# EAGLE design motor-shield02 (EAGLE 7.5.0)
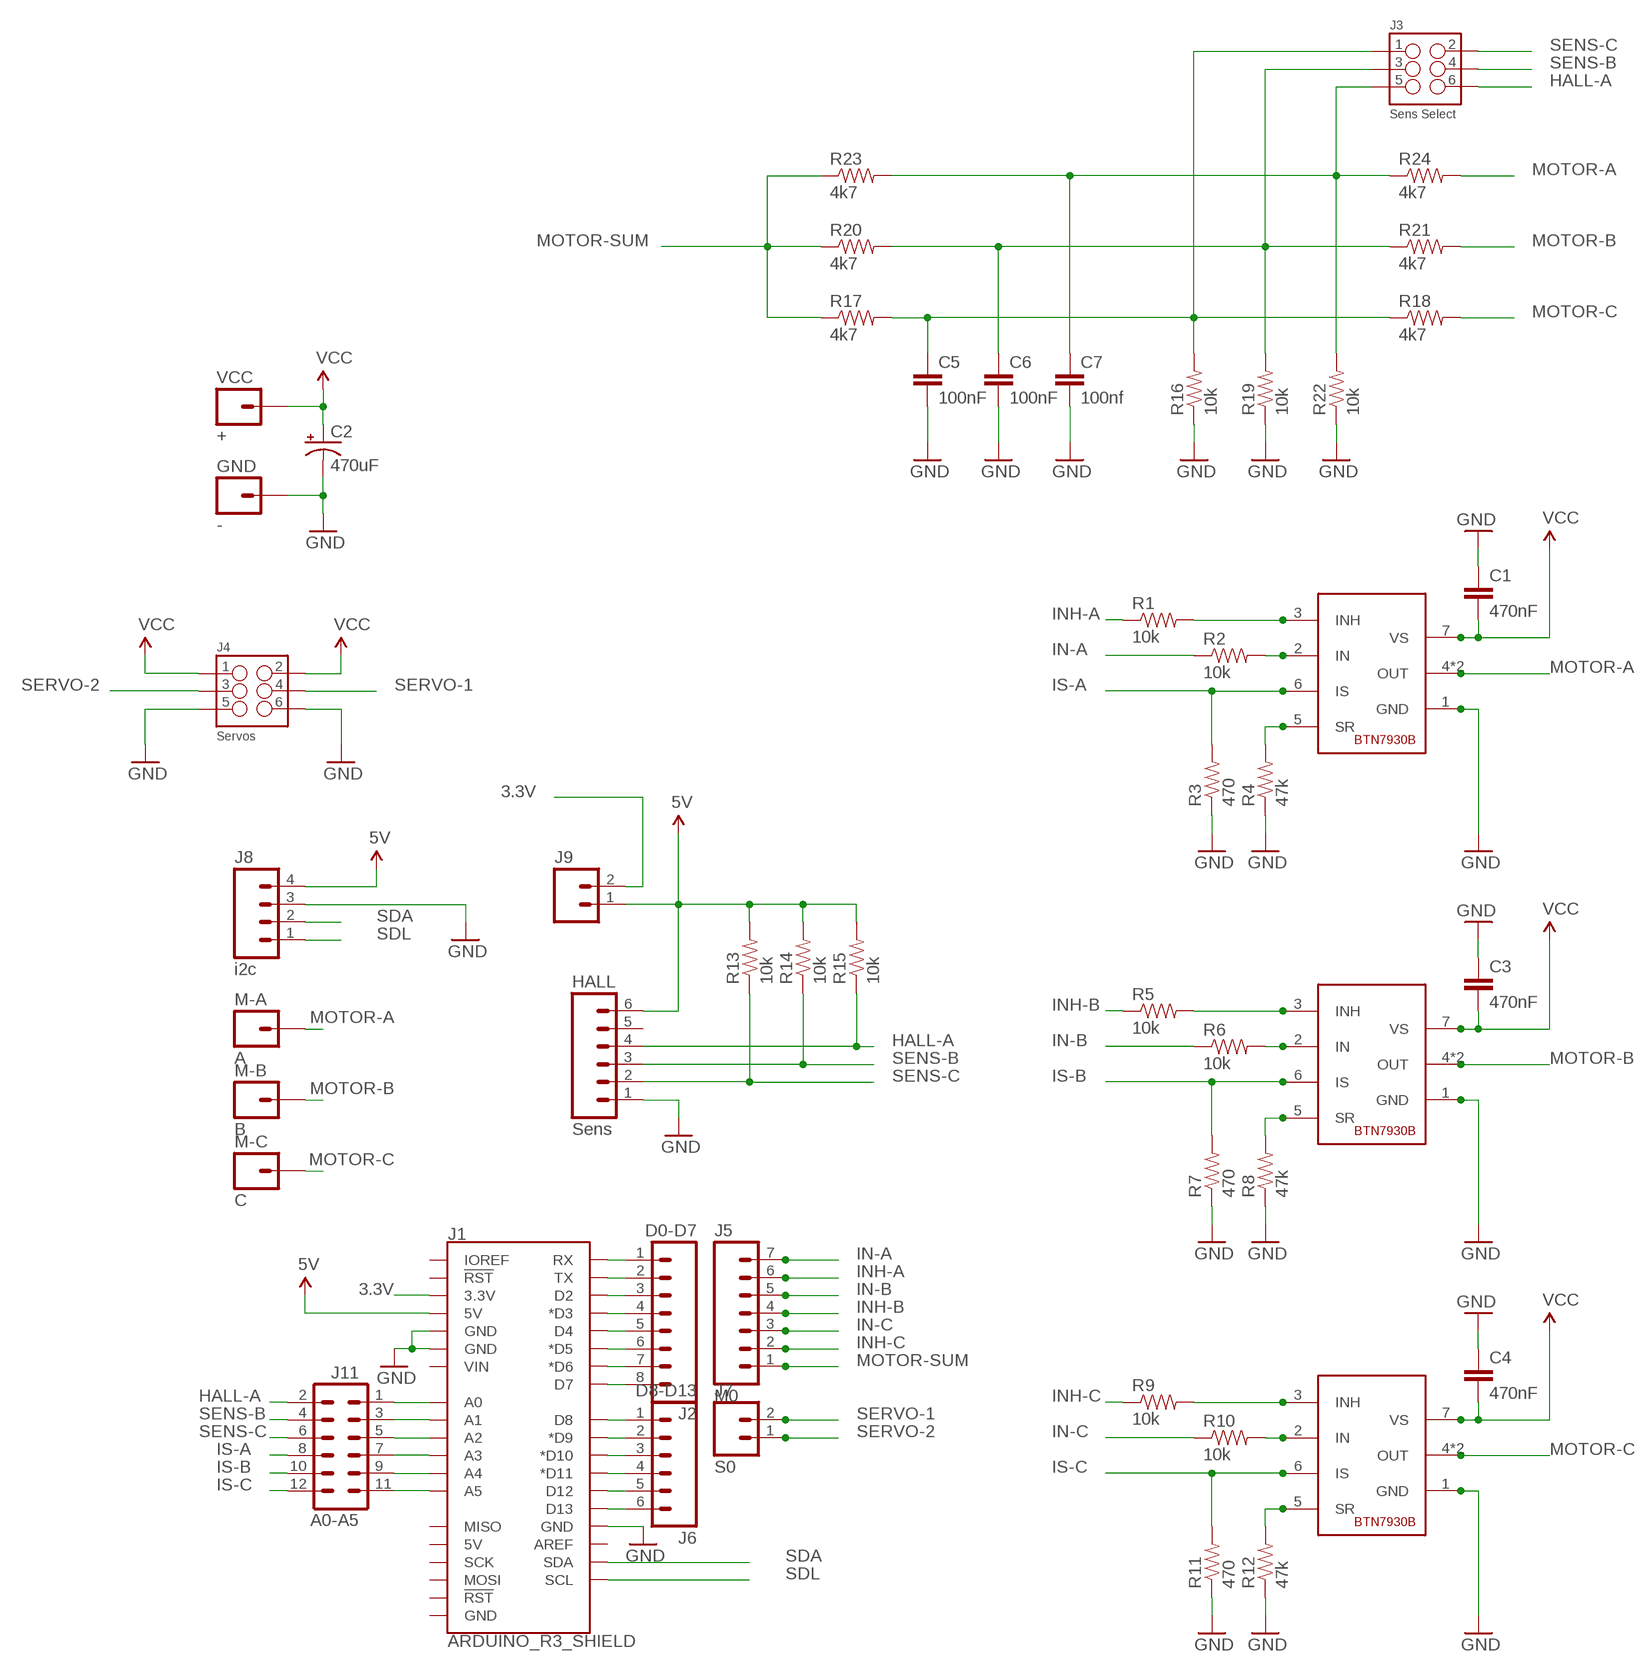
[diagram p0: schematic, sheet 1]

## Parts
C1  470nF  CAPEZ  [CAP-PTH-SMALLEZ]
C2  470uF  CAP_POLPTH1  [CPOL-RADIAL-100UF-25V]
C3  470nF  CAPEZ  [CAP-PTH-SMALLEZ]
C4  470nF  CAPEZ  [CAP-PTH-SMALLEZ]
C5  100nF  CAPEZ  [CAP-PTH-SMALLEZ]
C6  100nF  CAPEZ  [CAP-PTH-SMALLEZ]
C7  100nf  CAPEZ  [CAP-PTH-SMALLEZ]
DA  H-Bridge  INF-PG-TO263-7-1_L_1  [INF-PG-TO263-7-1_L_1PRIMARY]
DB  H-Bridge  INF-PG-TO263-7-1_L_1  [INF-PG-TO263-7-1_L_1PRIMARY]
DC  H-Bridge  INF-PG-TO263-7-1_L_1  [INF-PG-TO263-7-1_L_1PRIMARY]
GND  -  M01SMTRA-256-8-6  [SMTRA-256-8-6]
HALL  Sens  M06SMD-1MM  [1X06-1MM]
J1  ARDUINO_R3_SHIELD  ARDUINO_R3_SHIELD_ICSP  [UNO_R3_SHIELD_ICSP]
J2  D0-D7  M08NO_SILK_FEMALE_PTH  [1X08_NO_SILK]
J3  Sens Select  M03X2FEMALE  [2X3]
J4  Servos  M03X2FEMALE  [2X3]
J5  M0  M07NO_SILK  [1X07_NO_SILK]
J6  D8-D13  M06NO_SILK_YES_STOP  [1X06_NO_SILK_YES_STOP]
J7  S0  M021X02_NO_SILK  [1X02_NO_SILK]
J8  i2c  M04NO_SILK_ALL_ROUND  [1X04_NO_SILK_ALL_ROUND]
J9  M021X02_NO_SILK  [1X02_NO_SILK]
J11  A0-A5  M06X2PTH_FEMALE  [2X6]
M-A  A  M01SMTRA-256-8-6  [SMTRA-256-8-6]
M-B  B  M01SMTRA-256-8-6  [SMTRA-256-8-6]
M-C  C  M01SMTRA-256-8-6  [SMTRA-256-8-6]
R1  10k  10KOHM-1/4W-1%(PTH)HORIZ  [AXIAL-0.3]
R2  10k  10KOHM-1/4W-1%(PTH)HORIZ  [AXIAL-0.3]
R3  470  10KOHM-1/4W-1%(PTH)HORIZ  [AXIAL-0.3]
R4  47k  10KOHM-1/4W-1%(PTH)HORIZ  [AXIAL-0.3]
R5  10k  10KOHM-1/4W-1%(PTH)HORIZ  [AXIAL-0.3]
R6  10k  10KOHM-1/4W-1%(PTH)HORIZ  [AXIAL-0.3]
R7  470  10KOHM-1/4W-1%(PTH)HORIZ  [AXIAL-0.3]
R8  47k  10KOHM-1/4W-1%(PTH)HORIZ  [AXIAL-0.3]
R9  10k  10KOHM-1/4W-1%(PTH)HORIZ  [AXIAL-0.3]
R10  10k  10KOHM-1/4W-1%(PTH)HORIZ  [AXIAL-0.3]
R11  470  10KOHM-1/4W-1%(PTH)HORIZ  [AXIAL-0.3]
R12  47k  10KOHM-1/4W-1%(PTH)HORIZ  [AXIAL-0.3]
R13  10k  10KOHM-1/4W-1%(PTH)HORIZ  [AXIAL-0.3]
R14  10k  10KOHM-1/4W-1%(PTH)HORIZ  [AXIAL-0.3]
R15  10k  10KOHM-1/4W-1%(PTH)HORIZ  [AXIAL-0.3]
R16  10k  10KOHM-1/4W-1%(PTH)HORIZ  [AXIAL-0.3]
R17  4k7  10KOHM-1/4W-1%(PTH)HORIZ  [AXIAL-0.3]
R18  4k7  10KOHM-1/4W-1%(PTH)HORIZ  [AXIAL-0.3]
R19  10k  10KOHM-1/4W-1%(PTH)HORIZ  [AXIAL-0.3]
R20  4k7  10KOHM-1/4W-1%(PTH)HORIZ  [AXIAL-0.3]
R21  4k7  10KOHM-1/4W-1%(PTH)HORIZ  [AXIAL-0.3]
R22  10k  10KOHM-1/4W-1%(PTH)HORIZ  [AXIAL-0.3]
R23  4k7  10KOHM-1/4W-1%(PTH)HORIZ  [AXIAL-0.3]
R24  4k7  10KOHM-1/4W-1%(PTH)HORIZ  [AXIAL-0.3]
VCC  +  M01SMTRA-256-8-6  [SMTRA-256-8-6]

## Nets
3.3V: J1.3.3V J9.2
5V: HALL.6 J1.5V J8.4 J9.1 R13.P$2 R14.P$2 R15.P$2
GND: C1.1 C2.2(-) C3.1 C4.1 C5.2 C6.2 C7.2 DA.1(GND) DB.1(GND) DC.1(GND) GND.P$1 HALL.1 J1.GND@0(GND) J1.GND@1(GND) J1.GND@2(GND) J4.5 J4.6 J8.3 R3.P$1 R4.P$1 R7.P$1 R8.P$1 R11.P$1 R12.P$1 R16.P$1 R19.P$1 R22.P$1
HALL-A: HALL.4 J3.6 J11.2 R15.P$1
IN-A: J5.7 R2.P$1
IN-B: J5.5 R6.P$1
IN-C: J5.3 R10.P$1
INH-A: J5.6 R1.P$1
INH-B: J5.4 R5.P$1
INH-C: J5.2 R9.P$1
IS-A: DA.6(IS) J11.8 R3.P$2
IS-B: DB.6(IS) J11.10 R7.P$2
IS-C: DC.6(IS) J11.12 R11.P$2
MOTOR-A: DA.4(OUT) DA.8(OUT) M-A.P$1 R24.P$2
MOTOR-B: DB.4(OUT) DB.8(OUT) M-B.P$1 R21.P$2
MOTOR-C: DC.4(OUT) DC.8(OUT) M-C.P$1 R18.P$2
MOTOR-SUM: J5.1 R17.P$1 R20.P$1 R23.P$1
N$1: DA.3(INH) R1.P$2
N$2: DA.2(IN) R2.P$2
N$3: DB.3(INH) R5.P$2
N$4: DA.5(SR) R4.P$2
N$5: DB.2(IN) R6.P$2
N$6: DB.5(SR) R8.P$2
N$7: DC.3(INH) R9.P$2
N$8: DC.2(IN) R10.P$2
N$9: DC.5(SR) R12.P$2
N$10: J1.A0 J11.1
N$11: J1.A1 J11.3
N$12: J1.A2 J11.5
N$13: J1.RX J2.1
N$14: J1.TX J2.2
N$15: J1.D2 J2.3
N$16: J1.D3(*D3) J2.4
N$17: J1.D4 J2.5
N$18: J1.D5(*D5) J2.6
N$19: J1.D6(*D6) J2.7
N$20: J1.D7 J2.8
N$21: J1.D8 J6.1
N$22: J1.D9(*D9) J6.2
N$23: J1.D10(*D10) J6.3
N$24: J1.D11(*D11) J6.4
N$25: J1.D12 J6.5
N$26: J1.D13 J6.6
N$31: J1.A3 J11.7
N$32: J1.A4 J11.9
N$33: J1.A5 J11.11
N$42: C5.1 J3.1 R16.P$2 R17.P$2 R18.P$1
N$43: C6.1 J3.3 R19.P$2 R20.P$2 R21.P$1
N$45: C7.1 J3.5 R22.P$2 R23.P$2 R24.P$1
SDA: J1.SDA J8.2
SDL: J1.SCL J8.1
SENS-B: HALL.3 J3.4 J11.4 R14.P$1
SENS-C: HALL.2 J3.2 J11.6 R13.P$1
SERVO-1: J4.4 J7.2
SERVO-2: J4.3 J7.1
VCC: C1.2 C2.1(+) C3.2 C4.2 DA.7(VS) DB.7(VS) DC.7(VS) J4.1 J4.2 VCC.P$1
Unconnected: HALL.5 J1.5V_ICSP(5V) J1.AREF J1.GND_ICSP(GND) J1.IOREF J1.MISO J1.MOSI J1.RES(!RST!) J1.RST_ICSP(!RST!) J1.SCK J1.VIN

## Library data of the parts
C1 C3-C7 = SparkFun-Capacitors:CAP: Capacitor Standard 0603 ceramic capacitor, and 0.1" leaded capacitor.
C2 = SparkFun-Capacitors:CAP_POL: Capacitor Polarized These are standard SMD and PTH capacitors. Normally 10uF, 47uF, and 100uF in electrolytic and tantalum varieties. Always verify the external diameter of the through hole cap, it varies with capacity, voltage, and manufacturer. The EIA devices should be standard.
DA DB DC = BTN7930B-High Current PN Half Bridge:INF-PG-TO263-7-1_L_1
GND M-A M-B M-C VCC = SparkFun-Connectors:M01: Header 1 Standard 1-pin 0.1" header. Use with straight break away headers (SKU : PRT-00116), right angle break away headers (PRT-00553), swiss pins (PRT-00743), machine pins (PRT-00117), and female headers (PRT-00115). SMTSO-256-ET is a "flush mount" nut for a 4-40 screw. The older package used to be too tight, and did not allow it to sit properly thru the drill hit. The latest (0.165DIA) fits nice and snug.
HALL J6 = SparkFun-Connectors:M06: Header 6 Standard 6-pin 0.1" header. Use with straight break away headers (SKU : PRT-00116), right angle break away headers (PRT-00553), swiss pins (PRT-00743), machine pins (PRT-00117), and female headers (PRT-00115). Molex polarized connector foot print use with SKU : PRT-08094 with associated crimp pins and housings. NOTES ON THE VARIANTS LOCK and LOCK_LONGPADS... This footprint was designed to help hold the alignment of a through-hole component (i.e. 6-pin header) while soldering it into place. You may notice that each hole has been shifted either up or down by 0.005 of an inch from it's more standard position (which is a perfectly straight line). This slight alteration caused the pins (the squares in the middle) to touch the edges of the holes. Because they are alternating, it causes a "brace" to hold the component in place. 0.005 has proven to be the perfect amount of "off-center" position when using our standard breakaway headers. Although looks a little odd when you look at the bare footprint, once you have a header in there, the alteration is very hard to notice. Also,if you push a header all the way into place, it is covered up entirely on the bottom side. This idea of altering the position of holes to aid alignment will be further integrated into the Sparkfun Library for other footprints. It can help hold any component with 3 or more connection pins.
J1 = SparkFun-Boards:ARDUINO_R3_SHIELD_ICSP: Arduino R3 Shield Footprint w/ 6-pin (2x3) ICSP Header
J2 = SparkFun-Connectors:M08: Header 8 Standard 8-pin 0.1" header. Use with straight break away headers (SKU : PRT-00116), right angle break away headers (PRT-00553), swiss pins (PRT-00743), machine pins (PRT-00117), and female headers (PRT-00115).; PROD_ID: CONN-08438
J3 J4 = SparkFun-Connectors:M03X2: 2x3 .1" header. Shrouded, with keying- CONN-10681 SMT- CONN-11415 Pogo pins- HW-11044; PROD_ID: CONN-11566; VALUE: FEMALE 2x3
J5 = SparkFun-Connectors:M07: Header 7 Standard 7-pin 0.1" header. Use with straight break away headers (SKU : PRT-00116), right angle break away headers (PRT-00553), swiss pins (PRT-00743), machine pins (PRT-00117), and female headers (PRT-00115). NOTES ON THE VARIANTS LOCK and LOCK_LONGPADS... This footprint was designed to help hold the alignment of a through-hole component (i.e. 7-pin header) while soldering it into place. You may notice that each hole has been shifted either up or down by 0.005 of an inch from it's more standard position (which is usually a perfectly straight line). This slight alteration caused the pins (the squares in the middle) to touch the edges of the holes. Because they are alternating, it causes a "brace" to hold the header in place. 0.005 has proven to be the perfect amount of "off-center" position when using our standard breakaway headers. Although looks a little odd when you look at the bare footprint, once you have a header in there, the alteration is very hard to notice. Also, if you push a header all the way into place, it is covered up entirely on the bottom side. This idea of altering the position of holes to aid alignment will be further integrated into the Sparkfun Library for other footprints. It can help hold any component with 3 or more connection pins.
J7 J9 = SparkFun-Connectors:M02: Standard 2-pin 0.1" header. Use with - straight break away headers ( PRT-00116) - right angle break away headers (PRT-00553) - swiss pins (PRT-00743) - machine pins (PRT-00117) - female headers (PRT-00115) Molex polarized connector foot print use with: PRT-08233 with associated crimp pins and housings. 2.54_SCREWTERM for use with PRT-10571. 3.5mm Screw Terminal footprints for PRT-08084 5mm Screw Terminal footprints for use with PRT-08432
J8 = SparkFun-Connectors:M04: Header 4 Standard 4-pin 0.1" header. Use with straight break away headers (SKU : PRT-00116), right angle break away headers (PRT-00553), swiss pins (PRT-00743), machine pins (PRT-00117), and female headers (PRT-00115). Molex polarized connector foot print use with SKU : PRT-08231 with associated crimp pins and housings. 1MM SMD Version SKU: PRT-10208; PROD_ID: CONN-09696
J11 = SparkFun-Connectors:M06X2; PROD_ID: CONN-12423; VALUE: 2X6 FEMALE
R1 R2 R5 R6 R9 R10 R13-R16 R19 R22 = SparkFun-Resistors:10KOHM-1/4W-1%(PTH): RES-12183; PROD_ID: RES-12183
R3 R4 R7 R8 R11 R12 R17 R18 R20 R21 R23 R24 = SparkFun-Resistors:10KOHM-1/4W-1%(PTH): RES-12183; PROD_ID: RES-12183; VALUE: 10k

## Board
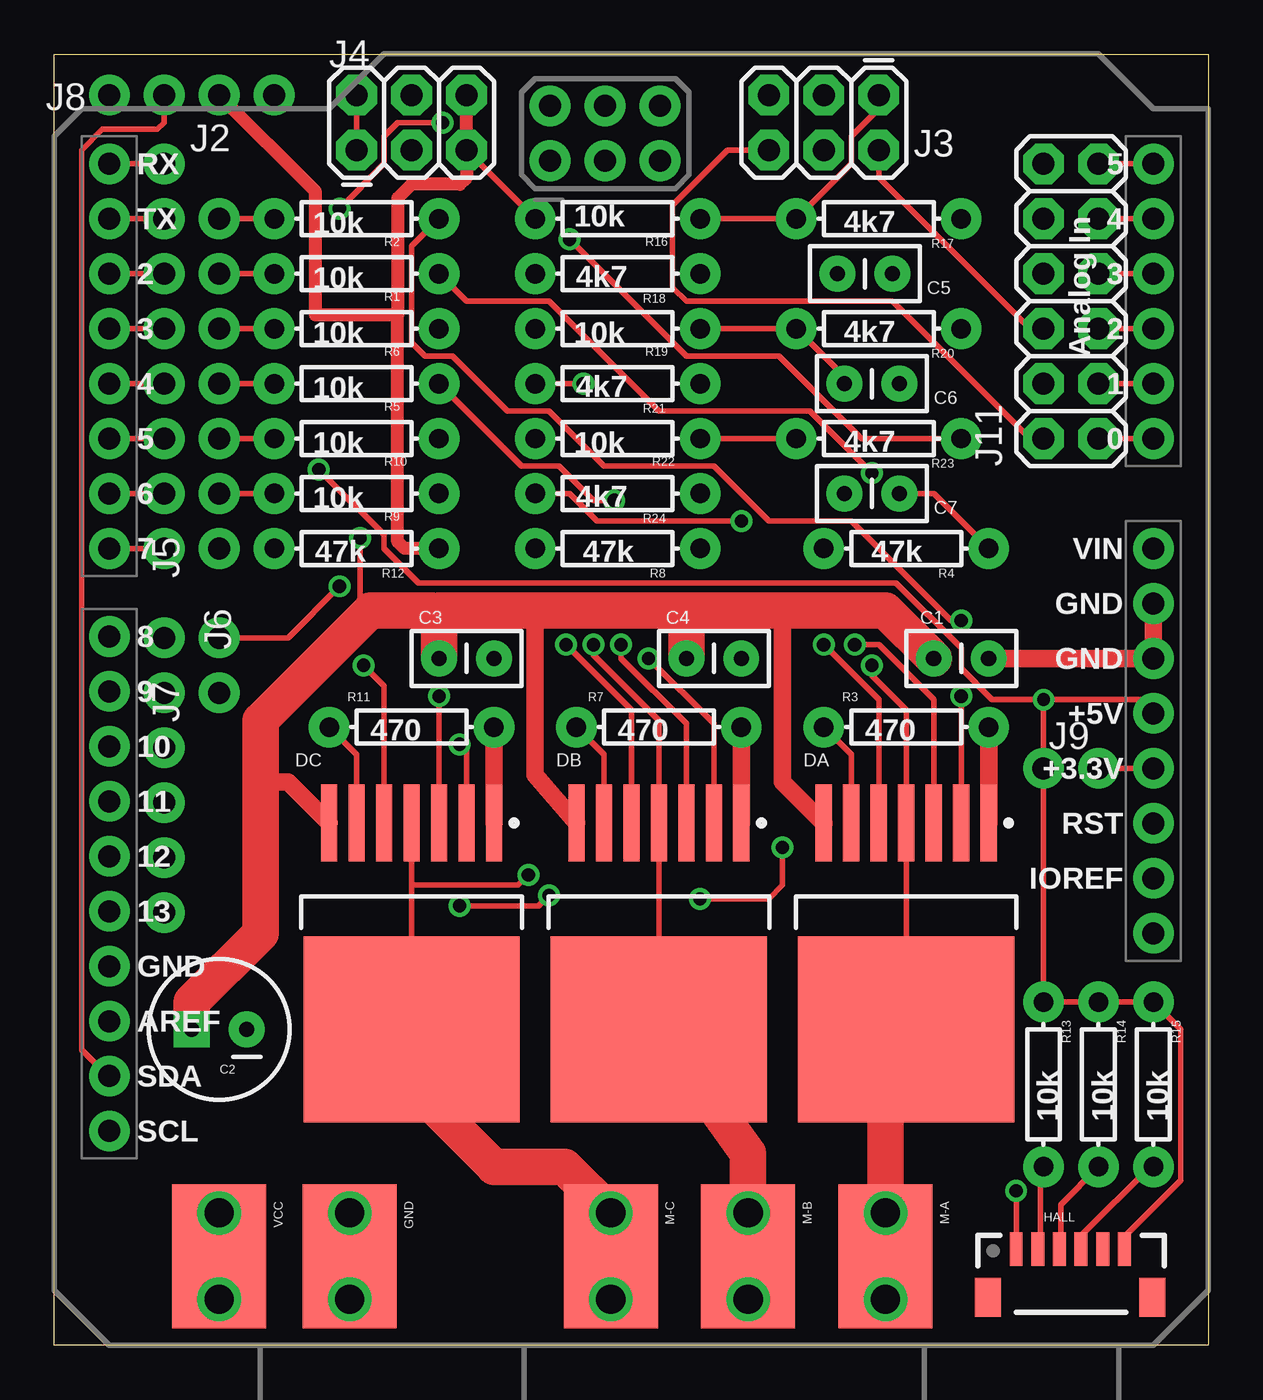
[diagram p1: board, top side]
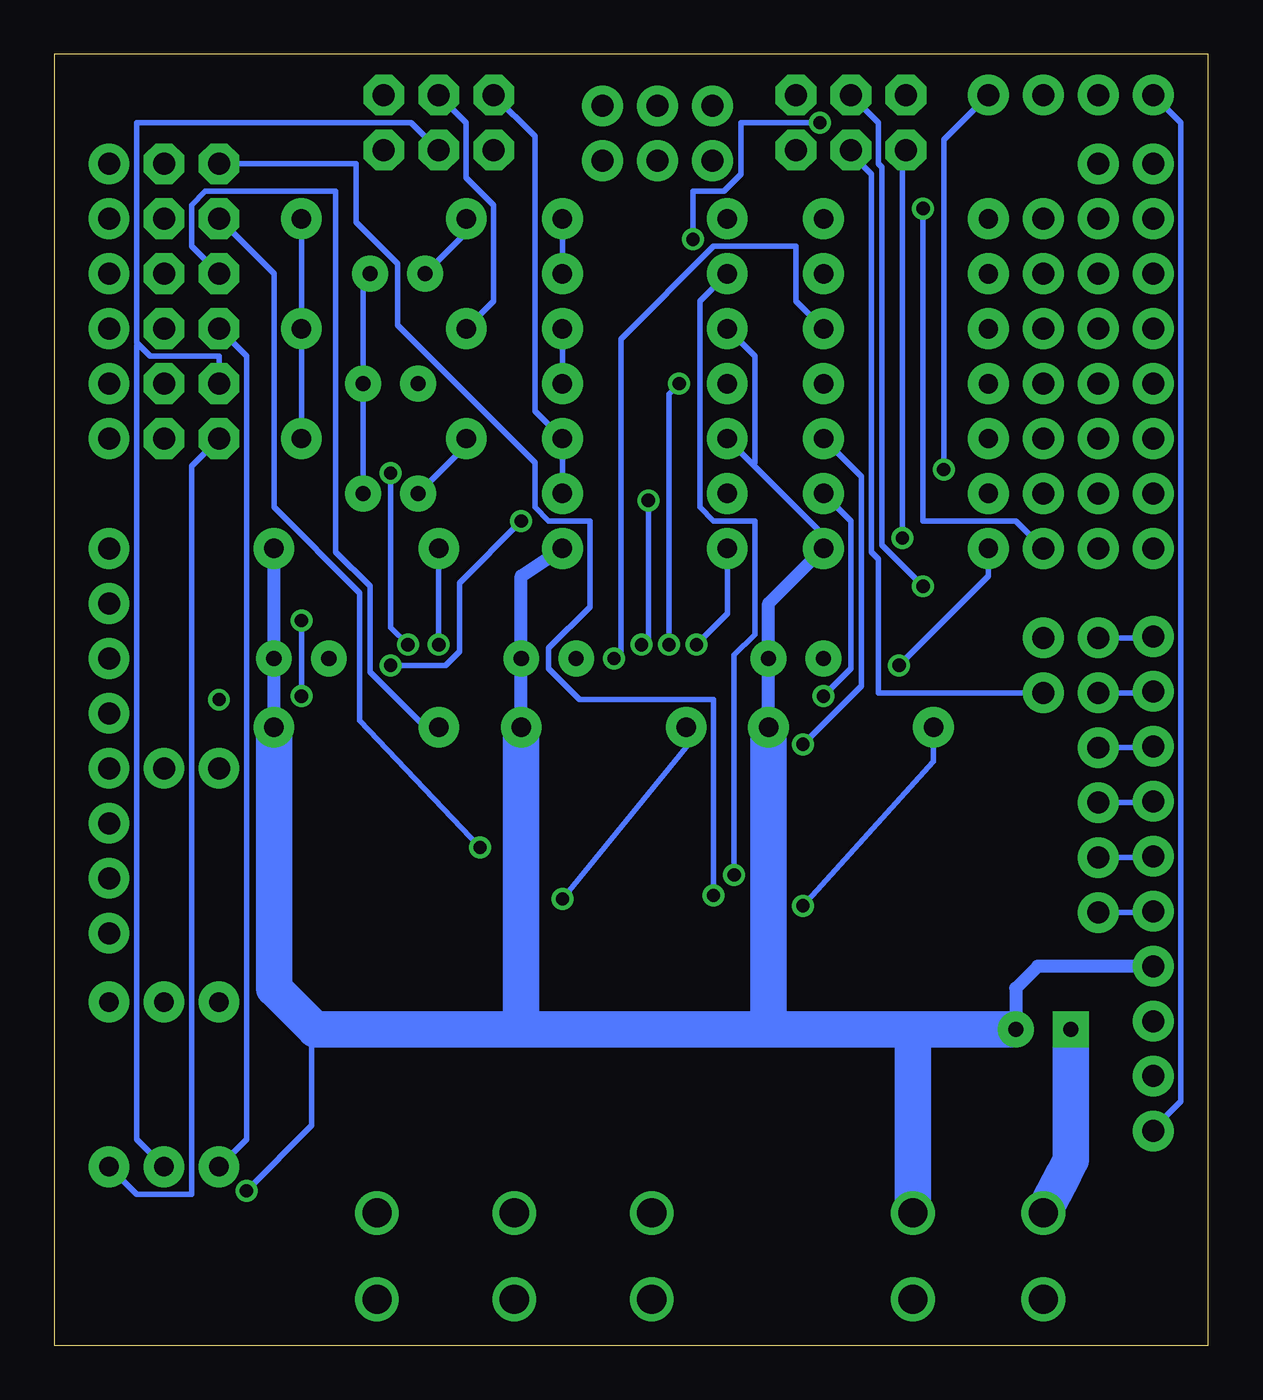
[diagram p2: board, bottom side, seen from below]

Size 53.35 x 59.68 mm. Coordinates in mm from the lower left corner, seen from the top.
Outline: 53.35,0 0,0 0,59.68 53.35,59.68 53.35,0
Copper layers (1*16): Top 0.035mm / dielectric 1.5mm / Bottom 0.035mm
Design rules "default *": minimum track width 10mil, minimum drill 24mil, track to track 8mil, track to pad 8mil, pad to pad 8mil, via to via 8mil, smd to smd 8mil, copper to edge 40mil, drill to drill 8mil, minimum pad ring 10mil, minimum via ring 8mil, stop-mask expansion 4mil, vias tented up to drill 0mil, thermal gap 10mil

### Footprints (pad centres in the part's own frame; a part is rotated, then mirrored left to right if it is on the bottom)
CAP-PTH-SMALLEZ = drill 0.7 pad 1.651: 1 0,0; 2 2.54,0
CPOL-RADIAL-100UF-25V = drill 0.7 pad 1.651 square: 1 1.27,0 | drill 0.7 pad 1.651: 2 -1.27,0
INF-PG-TO263-7-1_L_1PRIMARY = smd 3.55 x 0.75: 1 -6.05,3.81; 2 -6.05,2.54; 3 -6.05,1.27; 4 -6.05,0; 5 -6.05,-1.27; 6 -6.05,-2.54; 7 -6.05,-3.81 | smd 8.6 x 10: 8 3.5,0
SMTRA-256-8-6 = drill 1.346: P$1 -1.994,0; P$2 1.994,0 | smd 6.655 x 4.343: P$3 0,0
1X06-1MM = smd 0.6 x 1.55: 1 -2.54,1.27; 2 -1.54,1.27; 3 -0.54,1.27; 4 0.46,1.27; 5 1.46,1.27; 6 2.46,1.27 | smd 1.2 x 1.8: P$1 -3.84,-0.955; P$2 3.76,-0.955
UNO_R3_SHIELD_ICSP = drill 1.016 pad 1.88: 3.3V 50.8,26.67; 5V 50.8,29.21; 5V_ICSP 22.91,57.29; A0 50.8,41.91; A1 50.8,44.45; A2 50.8,46.99; A3 50.8,49.53; A4 50.8,52.07; A5 50.8,54.61; AREF 2.54,14.986; D2 2.54,49.53; D3 2.54,46.99; D4 2.54,44.45; D5 2.54,41.91; D6 2.54,39.37; D7 2.54,36.83; D8 2.54,32.766; D9 2.54,30.226; D10 2.54,27.686; D11 2.54,25.146; D12 2.54,22.606; D13 2.54,20.066; GND@0 50.8,31.75; GND@1 50.8,34.29; GND@2 2.54,17.526; GND_ICSP 27.99,57.29; IOREF 50.8,21.59; MISO 22.91,54.75; MOSI 25.45,57.29; NC 50.8,19.05; RES 50.8,24.13; RST_ICSP 27.99,54.75; RX 2.54,54.61; SCK 25.45,54.75; SCL 2.54,9.906; SDA 2.54,12.446; TX 2.54,52.07; VIN 50.8,36.83
1X08_NO_SILK = drill 1.016 pad 1.88: 1 0,0; 2 2.54,0; 3 5.08,0; 4 7.62,0; 5 10.16,0; 6 12.7,0; 7 15.24,0; 8 17.78,0
2X3 = drill 1.016 pad 1.88 octagon: 1 0,0; 2 0,2.54; 3 2.54,0; 4 2.54,2.54; 5 5.08,0; 6 5.08,2.54
1X07_NO_SILK = drill 1.016 pad 1.88: 1 0,0; 2 2.54,0; 3 5.08,0; 4 7.62,0; 5 10.16,0; 6 12.7,0; 7 15.24,0
1X06_NO_SILK_YES_STOP = drill 1.016 pad 1.88: 1 0,0; 2 2.54,0; 3 5.08,0; 4 7.62,0; 5 10.16,0; 6 12.7,0
1X02_NO_SILK = drill 1.016 pad 1.88: 1 0,0; 2 2.54,0
1X04_NO_SILK_ALL_ROUND = drill 1.016 pad 1.88: 1 0,0; 2 2.54,0; 3 5.08,0; 4 7.62,0
2X6 = drill 1.016 pad 1.88 octagon: 1 0,0; 2 0,2.54; 3 2.54,0; 4 2.54,2.54; 5 5.08,0; 6 5.08,2.54; 7 7.62,0; 8 7.62,2.54; 9 10.16,0; 10 10.16,2.54; 11 12.7,0; 12 12.7,2.54
AXIAL-0.3 = drill 0.9 pad 1.88: P$1 -3.81,0; P$2 3.81,0

### Placement (x,y rotation side)
C1  43.19,31.75 180 top
C2  7.63,14.61 180 top
C3  20.33,31.75 180 top
C4  31.76,31.75 180 top
C5  36.21,49.53 0 top
C6  36.52,44.45 0 top
C7  36.52,39.37 0 top
DA  39.38,18.1 270 top
DB  27.95,18.1 270 top
DC  16.52,18.1 270 top
GND  13.66,4.13 270 top
HALL  47,3.17 0 top
J1  0.01,0 0 top
J2  5.09,54.61 270 top
J3  38.11,57.78 180 top
J4  13.98,55.24 0 top
J5  7.63,36.83 90 top
J6  5.09,32.7 270 top
J7  7.63,30.16 90 top
J8  2.55,57.78 0 top
J9  45.73,26.67 0 top
J11  48.27,41.91 90 top
M-A  38.43,4.13 270 top
M-B  32.08,4.13 270 top
M-C  25.73,4.13 270 top
R1  13.98,49.53 0 top
R2  13.98,52.07 0 top
R3  39.38,28.57 180 top
R4  39.38,36.83 180 top
R5  13.98,44.45 0 top
R6  13.98,46.99 0 top
R7  27.95,28.57 180 top
R8  26.05,36.83 180 top
R9  13.98,39.37 0 top
R10  13.98,41.91 0 top
R11  16.52,28.57 180 top
R12  13.98,36.83 180 top
R13  45.73,12.07 90 top
R14  48.27,12.07 90 top
R15  50.81,12.07 90 top
R16  26.05,52.07 0 top
R17  38.11,52.07 180 top
R18  26.05,49.53 180 top
R19  26.05,46.99 0 top
R20  38.11,46.99 180 top
R21  26.05,44.45 180 top
R22  26.05,41.91 0 top
R23  38.11,41.91 180 top
R24  26.05,39.37 180 top
VCC  7.63,4.13 270 top

### Tracks (layer width: path | path; a pad name or v marks a point on that pad's centre or on a via)
3.3V
  Top 0.254: J1.3.3V J9.2
5V  (via drill 0.6, 0.61)
  Top 0.254: HALL.6 49.54,4.44 49.54,5.08 52.08,7.62 52.08,14.61 R15.P$2 R14.P$2 R13.P$2 J9.1 v45.73,29.84 | v12.24,40.48 15.25,37.46 15.25,36.83 16.84,35.24 38.91,35.24 41.92,32.23 41.92,31.27 43.35,29.84 v45.73,29.84 | v45.73,29.84 50.18,29.84 J1.5V
  Bottom 0.254: J8.4 12.24,55.72 v12.24,40.48
GND  (via drill 0.61)
  Top 0.254: v44.46,7.14 HALL.1 | J4.5 R16.P$1 | C7.2 40.65,39.37 R4.P$1
  Top 0.61: J4.6 J4.5 19.06,53.98 18.74,53.66 16.52,53.66 15.89,53.02 15.89,47.62 | 15.89,47.62 12.08,47.62 12.08,53.34 J8.3 | R12.P$1 16.21,36.83 15.89,37.15 15.89,47.62
  Top 0.813: DA.1 R3.P$1 | DB.1 R7.P$1 | C1.1 J1.GND@0 J1.GND@1 | R11.P$1 DC.1
  Bottom 0.254: C7.2 C6.2 39.07,49.21 C5.2 | v44.46,7.14 41.45,10.16 41.45,13.81 41.29,14.61 | 21.05,40.72 17.95,37.62 17.95,36.99 R12.P$1 | 21.05,40.72 R22.P$1 | R19.P$1 20.97,45.72 20.97,40.8 21.05,40.72
  Bottom 0.61: R11.P$1 C3.1 20.33,34.29 R12.P$1 | R7.P$1 C4.1 31.76,35.56 R8.P$1 | R3.P$1 C1.1 R4.P$1 | J1.GND@2 7.89,17.53 8.9,16.51 C2.2
  Bottom 1.676: GND.P$1 13.66,14.61 | 13.66,14.61 20.65,14.61 | 20.65,14.61 31.76,14.61 | 31.76,14.61 41.29,14.61 43.19,16.51 R3.P$1 | R7.P$1 31.76,14.61 | R11.P$1 20.33,14.92 20.65,14.61 | 13.66,14.61 C2.2
HALL-A
  Top 0.254: 45.73,41.59 J11.2 45.1,41.91 38.75,48.26 29.22,48.26 28.59,48.89 28.59,52.7 31.13,55.24 J3.6 | R15.P$1 50.65,8.26 47.48,5.08 47.48,4.44 HALL.4
  Bottom 0.254: R15.P$1 49.54,6.99 47,6.99 47,40.64 J11.2
IN-A
  Top 0.254: R2.P$1 J5.7
IN-B
  Top 0.254: R6.P$1 J5.5
IN-C
  Top 0.254: R10.P$1 J5.3
INH-A
  Top 0.254: R1.P$1 J5.6
INH-B
  Top 0.254: R5.P$1 J5.4
INH-C
  Top 0.254: R9.P$1 J5.2
IS-A
  Top 0.254: DA.6 36.84,27.3 R3.P$2
  Bottom 0.254: J11.8 47,50.8 47,52.7 46.37,53.34 40.33,53.34 40.33,36.67 38.75,35.08 38.75,31.12 36.21,28.57 R3.P$2
IS-B  (via drill 0.61)
  Top 0.254: DB.6 25.41,27.3 R7.P$2 | v33.67,23.02 33.67,21.27 33.03,20.64 v29.86,20.64
  Bottom 0.254: J11.10 43.19,49.53 43.19,38.73 39.22,34.77 39.22,28.89 v33.67,23.02 | v29.86,20.64 24.14,27.62 R7.P$2
IS-C  (via drill 0.61)
  Top 0.254: DC.6 13.98,27.3 R11.P$2 | v18.74,20.32 22.4,20.32 v22.87,20.8
  Bottom 0.254: J11.12 39.38,54.61 39.38,51.91 37.48,50.01 37.48,47.15 31.13,40.8 31.13,38.73 30.49,38.1 28.59,38.1 28.59,34.13 30.49,32.23 30.49,31.27 29.06,29.84 22.87,29.84 v22.87,20.8 | v18.74,20.32 12.71,26.99 R11.P$2
MOTOR-A  (via drill 0.61)
  Top 0.254: DA.8 DA.4 39.38,29.37 37.8,30.96 v37.8,31.43 | R24.P$2 23.83,39.37 25.1,38.1 v31.76,38.1
  Top 1.676: M-A.P$1 38.43,13.33 DA.8
  Bottom 0.254: v31.76,38.1 34.62,35.24 34.62,32.07 35.26,31.43 v37.8,31.43
MOTOR-B  (via drill 0.61)
  Top 0.254: DB.8 DB.4 27.95,28.89 24.94,31.91 v24.94,32.38 | v24.46,44.45 R21.P$2
  Top 1.676: M-B.P$1 32.08,8.88 DB.8
  Bottom 0.254: v24.46,44.45 24.94,43.97 v24.94,32.38
MOTOR-C  (via drill 0.61)
  Top 0.254: DC.4 16.52,21.27 | 16.52,21.27 DC.8 | v21.92,21.75 21.44,21.27 16.52,21.27
  Top 1.676: DC.8 14.31,14.28 20.33,8.26 23.6,8.26 M-C.P$1
  Bottom 0.254: R18.P$2 23.51,48.26 23.51,38.73 22.87,38.1 20.97,38.1 20.97,32.86 21.92,31.91 v21.92,21.75
MOTOR-SUM  (via drill 0.61)
  Top 0.254: v13.19,52.55 15.25,54.61 15.25,55.88 15.89,56.52 v17.95,56.52 | v23.83,51.12 29.22,45.72 33.51,45.72 37.32,41.91 R23.P$1
  Bottom 0.254: R17.P$1 R20.P$1 R23.P$1 | J5.1 8.9,38.1 13.19,38.1 v13.19,52.55 | v17.95,56.52 21.6,56.52 21.6,54.13 22.4,53.34 23.83,53.34 v23.83,51.12
N$1  (via drill 0.61)
  Top 0.254: 40.65,24.13 DA.3 40.65,29.84 38.11,32.38 v37,32.38 | v37.8,40.32 34.94,43.18 27.95,43.18 22.87,48.26 19.06,48.26 R1.P$2
  Bottom 0.254: v37,32.38 37.8,33.18 v37.8,40.32
N$2  (via drill 0.61)
  Top 0.254: 41.92,24.13 DA.2 v41.92,30 | v41.92,33.5 41.45,33.5 36.84,38.1 33.03,38.1 30.49,40.64 25.41,40.64 22.87,43.18 20.97,43.18 18.43,45.72 17.16,45.72 16.52,46.35 16.52,50.8 R2.P$2
  Bottom 0.254: v41.92,33.5 v41.92,30
N$3  (via drill 0.61)
  Top 0.254: 29.22,24.13 DB.3 29.22,28.73 26.21,31.75 v26.21,32.38 | v25.89,39.05 24.94,39.05 23.35,40.64 21.6,40.64 R5.P$2
  Bottom 0.254: v26.21,32.38 25.89,32.7 v25.89,39.05
N$4  (via drill 0.61)
  Top 0.254: 38.11,24.13 DA.5 38.11,29.84 v35.57,32.38
  Bottom 0.254: R4.P$2 v35.57,32.38
N$5  (via drill 0.61)
  Top 0.254: 30.49,24.13 DB.2 30.49,28.73 v27.48,31.75
  Bottom 0.254: v27.48,31.75 27.16,32.07 27.16,46.51 22.87,50.8 19.06,50.8 19.06,48.26 R6.P$2
N$6  (via drill 0.61)
  Top 0.254: 26.68,24.13 DB.5 26.68,29.37 v23.67,32.38
  Bottom 0.254: v23.67,32.38 22.24,33.81 R8.P$2
N$7  (via drill 0.61)
  Top 0.254: 17.79,24.13 DC.3 v17.79,30
  Bottom 0.254: v17.79,30 16.52,31.27 16.52,38.1 R9.P$2
N$8  (via drill 0.61)
  Top 0.254: 19.06,24.13 DC.2 19.06,27.46 v18.74,27.78
  Bottom 0.254: v18.74,27.78 16.05,30.48 16.05,40.16 R10.P$2
N$9  (via drill 0.61)
  Top 0.254: 15.25,24.13 DC.5 15.25,30.48 v14.3,31.43
  Bottom 0.254: v14.3,31.43 10.17,35.56 R12.P$2
N$10
  Top 0.254: J1.A0 J11.1
N$11
  Top 0.254: J1.A1 J11.3
N$12
  Top 0.254: J1.A2 J11.5
N$13
  Top 0.254: J2.1 J1.RX
N$14
  Top 0.254: J2.2 J1.TX
N$15
  Top 0.254: J2.3 J1.D2
N$16
  Top 0.254: J2.4 J1.D3
N$17
  Top 0.254: J2.5 J1.D4
N$18
  Top 0.254: J2.6 J1.D5
N$19
  Top 0.254: J2.7 J1.D6
N$20
  Top 0.254: J2.8 J1.D7
N$21
  Bottom 0.254: J6.1 2.55,32.7 J1.D8
N$22
  Bottom 0.254: J6.2 2.55,30.16 J1.D9
N$23
  Bottom 0.254: J6.3 2.55,27.62 J1.D10
N$24
  Bottom 0.254: J6.4 2.55,25.08 J1.D11
N$25
  Bottom 0.254: J6.5 2.55,22.54 J1.D12
N$26
  Bottom 0.254: J6.6 2.55,20 J1.D13
N$31
  Top 0.254: J1.A3 J11.7
N$32
  Top 0.254: J1.A4 J11.9
N$33
  Top 0.254: J1.A5 J11.11
N$42
  Top 0.254: J3.1 38.11,57.15 36.84,55.88 36.84,54.61 R17.P$2 R16.P$2
  Bottom 0.254: R16.P$2 R18.P$1 | C5.1 34.3,51.44 R17.P$2
N$43
  Top 0.254: C6.1 36.52,44.77 R20.P$2 R19.P$2
  Bottom 0.254: R19.P$2 R21.P$1 | J3.3 34.3,56.52 34.3,53.98 33.03,52.7 33.03,48.26 R20.P$2
N$45
  Top 0.254: R22.P$2 R23.P$2
  Bottom 0.254: C7.1 34.3,41.59 R23.P$2 | R24.P$1 R22.P$2 31.13,43.18 31.13,55.88 J3.5
SDA
  Top 0.254: J1.SDA 2.49,12.45 1.28,13.65 1.28,55.24 2.24,56.2 4.78,56.2 5.09,56.52 J8.2
SDL
  Bottom 0.254: J8.1 1.28,56.52 1.28,11.27 2.55,10 J1.SCL
SENS-B
  Top 0.254: R14.P$1 46.53,6.51 46.53,4.44 HALL.3
  Bottom 0.254: J3.4 36.84,56.52 49.54,56.52 49.54,46.35 49.46,46.28 | 49.46,46.28 48.91,45.72 45.73,45.72 J11.4 | R14.P$1 49.54,9.53 49.54,46.2 49.46,46.28
SENS-C
  Top 0.254: R13.P$1 45.57,8.1 45.57,4.44 HALL.2 | J11.6 45.1,46.99 38.11,53.98 J3.2
  Bottom 0.254: R13.P$1 44.46,9.53 44.46,45.72 J11.6
SERVO-1  (via drill 0.61)
  Top 0.254: J7.2 10.81,32.7 v13.19,35.08
  Bottom 0.254: v13.19,35.08 15.09,36.99 15.09,54.45 15.25,54.61 15.25,56.52 J4.4
SERVO-2
  Bottom 0.254: J7.1 15.25,30.16 15.25,36.35 15.57,36.67 15.57,54.13 16.52,55.09 J4.3
VCC  (via drill 0.61)
  Top 0.254: J4.2 J4.1 | v14.14,37.31 14.14,34.61 14.62,33.97
  Top 0.813: C1.2 40.33,31.75 | DA.7 35.57,24.13 33.67,26.04 33.67,33.97 | DB.7 22.24,26.35 22.24,33.97 | DC.7 10.82,26.04 9.54,26.04
  Top 1.676: 29.22,33.97 33.67,33.97 38.43,33.97 C1.2 | 29.22,33.97 22.24,33.97 17.79,33.97 17.79,33.66 | 17.79,33.66 C3.2 | C4.2 29.22,33.97 | C2.1 6.36,15.88 9.54,19.05 9.54,26.04 9.54,28.89 14.62,33.97 17.47,33.97 17.79,33.66
  Bottom 0.254: J4.1 14.14,55.09 v14.14,37.31
  Bottom 1.676: VCC.P$1 6.68,7.94 6.36,8.57 C2.1